# Altium schematic sheet shudian_controller.SchDoc
size A4
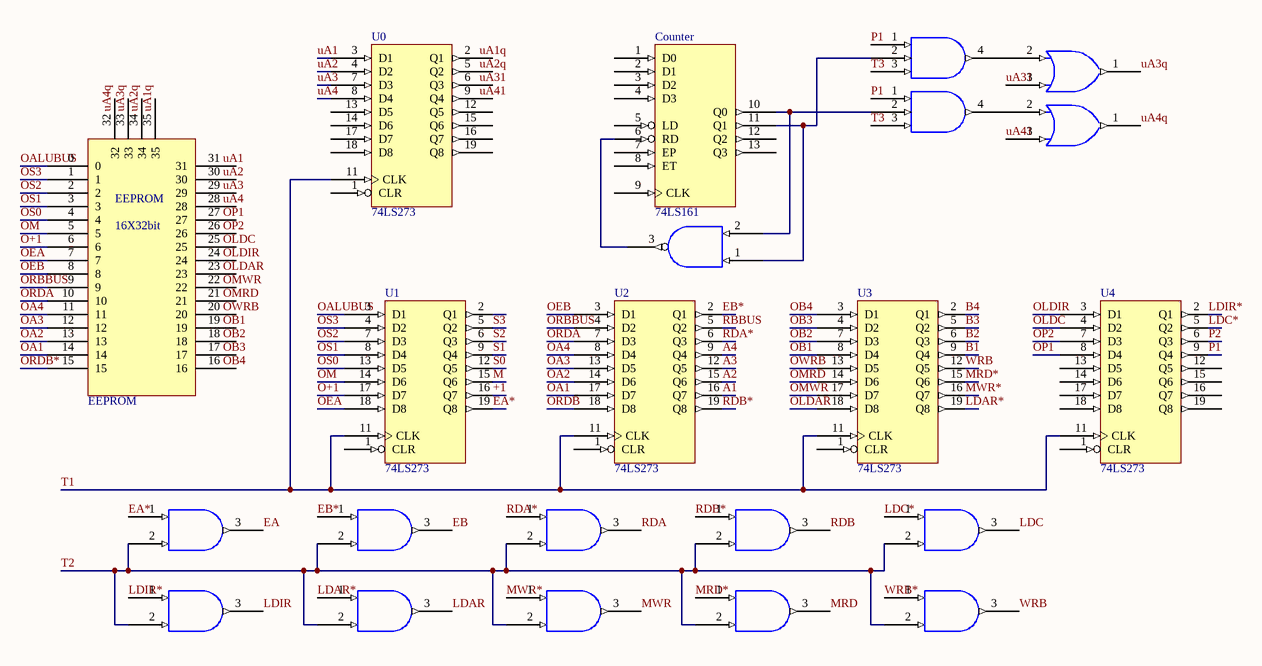
[diagram p0: shudian_controller.SchDoc]

## Parts
(Parts that share a designator on the sheet are numbered #1, #2 ... from top to bottom, then left to right.)
*  nand  (value not drawn)
*31  3inAND  (value not drawn)
*32  3inAND  (value not drawn)
*OR11  or  (value not drawn)
?#1  and  (value not drawn)
?#2  and  (value not drawn)
?#3  and  (value not drawn)
?#4  and  (value not drawn)
?#5  and  (value not drawn)
?#6  and  (value not drawn)
?#7  (no value)
?#8  and  (value not drawn)
?#9  and  (value not drawn)
?#10  and  (value not drawn)
Counter  74LS161
EEPROM  EEPROM  (value not drawn)
OR12  or  (value not drawn)
U0  74LS273  [DIP-20]
U1  74LS273  [DIP-20]
U2  74LS273  [DIP-20]
U3  74LS273  [DIP-20]
U4  74LS273  [DIP-20]

## Nets
GND: U0.10(GND) U1.10(GND) U2.10(GND) U3.10(GND) U4.10(GND)
VCC: U0.20(VCC) U1.20(VCC) U2.20(VCC) U3.20(VCC) U4.20(VCC)
+1: U1.16(Q7)
A1: U2.16(Q7)
A2: U2.15(Q6)
A3: U2.12(Q5)
A4: U2.9(Q4)
B1: U3.9(Q4)
B2: U3.6(Q3)
B3: U3.5(Q2)
B4: U3.2(Q1)
EA: ?#1.3
EA*: ?#1.1 U1.19(Q8)
EB: ?#2.3
EB*: ?#2.1 U2.2(Q1)
LDAR: ?#7.3
LDAR*: ?#7.1 U3.19(Q8)
LDC: ?#5.3
LDC*: ?#5.1 U4.5(Q2)
LDIR: ?#6.3
LDIR*: ?#6.1 U4.2(Q1)
M: U1.15(Q6)
MRD: ?#9.3
MRD*: ?#9.1 U3.15(Q6)
MWR: ?#8.3
MWR*: ?#8.1 U3.16(Q7)
O+1: EEPROM.6 U1.17(D7)
OA1: EEPROM.14 U2.17(D7)
OA2: EEPROM.13 U2.14(D6)
OA3: EEPROM.12 U2.13(D5)
OA4: EEPROM.11 U2.8(D4)
OALUBUS: EEPROM.0 U1.3(D1)
OB1: U3.8(D4)
OB2: U3.7(D3)
OB3: U3.4(D2)
OB4: U3.3(D1)
OEA: EEPROM.7 U1.18(D8)
OEB: EEPROM.8 U2.3(D1)
OLDAR: U3.18(D8)
OLDC: U4.4(D2)
OLDIR: U4.3(D1)
OM: EEPROM.5 U1.14(D6)
OMRD: U3.14(D6)
OMWR: U3.17(D7)
OP1: U4.8(D4)
OP2: U4.7(D3)
ORBBUS: EEPROM.9 U2.4(D2)
ORDA: EEPROM.10 U2.7(D3)
ORDB: U2.18(D8)
ORDB*: EEPROM.15
OS0: EEPROM.4 U1.13(D5)
OS1: EEPROM.3 U1.8(D4)
OS2: EEPROM.2 U1.7(D3)
OS3: EEPROM.1 U1.4(D2)
OWRB: U3.13(D5)
P1: *31.1 *32.1 U4.9(Q4)
P2: U4.6(Q3)
RBBUS: U2.5(Q2)
RDA: ?#3.3
RDA*: ?#3.1 U2.6(Q3)
RDB: ?#4.3
RDB*: ?#4.1 U2.19(Q8)
S0: U1.12(Q5)
S1: U1.9(Q4)
S2: U1.6(Q3)
S3: U1.5(Q2)
T1: U0.11(CLK) U1.11(CLK) U2.11(CLK) U3.11(CLK) U4.11(CLK)
T2: ?#1.2 ?#2.2 ?#3.2 ?#4.2 ?#5.2 ?#6.2 ?#7.2 ?#8.2 ?#9.2 ?#10.2
T3: *31.3 *32.3
uA1: U0.3(D1)
uA2: U0.4(D2)
uA3: U0.7(D3)
uA3q: *OR11.1
uA4: U0.8(D4)
uA4q: OR12.1
uA31: *OR11.3
uA41: OR12.3
WRB: ?#10.3 U3.12(Q5)
WRB*: ?#10.1
Net*31_4: *31.4 *OR11.2
Net*32_4: *32.4 OR12.2
Net*_1: *.1 *31.2 Counter.11(Q1)
Net*_2: *.2 *32.2 Counter.10(Q0)
Net*_3: *.3 Counter.6(RD)

Not connected (* = marked no-connect by the designer): Counter 1(D0) 2(D1) 3(D2) 4(D3) 5(LD) 7(EP) 8(ET) 9(CLK) 12(Q2) 13(Q3); EEPROM 16 17 18 19 20 21 22 23 24 25 26 27 28 29 30 31 32 33 34 35; U0 1(CLR) 2(Q1) 5(Q2) 6(Q3) 9(Q4) 12(Q5) 13(D5) 14(D6) 15(Q6) 16(Q7) 17(D7) 18(D8) 19(Q8); U1 1(CLR) 2(Q1); U2 1(CLR); U3 1(CLR); U4 1(CLR) 12(Q5) 13(D5) 14(D6) 15(Q6) 16(Q7) 17(D7) 18(D8) 19(Q8)

## Notes on the sheet
- Labels drawn without touching a wire or pin: OB1, OB2, OB3, OB4, OLDAR, OLDC, OLDIR, OMRD, OMWR, OP1, OP2, OWRB, uA1, uA1q, uA2, uA2q, uA3, uA3q, uA4, uA4q, uA31, uA41
- (in symbol EEPROM) 16X32bit

## Library data of the parts
?#7 = and